# EAGLE design ei2c (EAGLE 7.2.0)
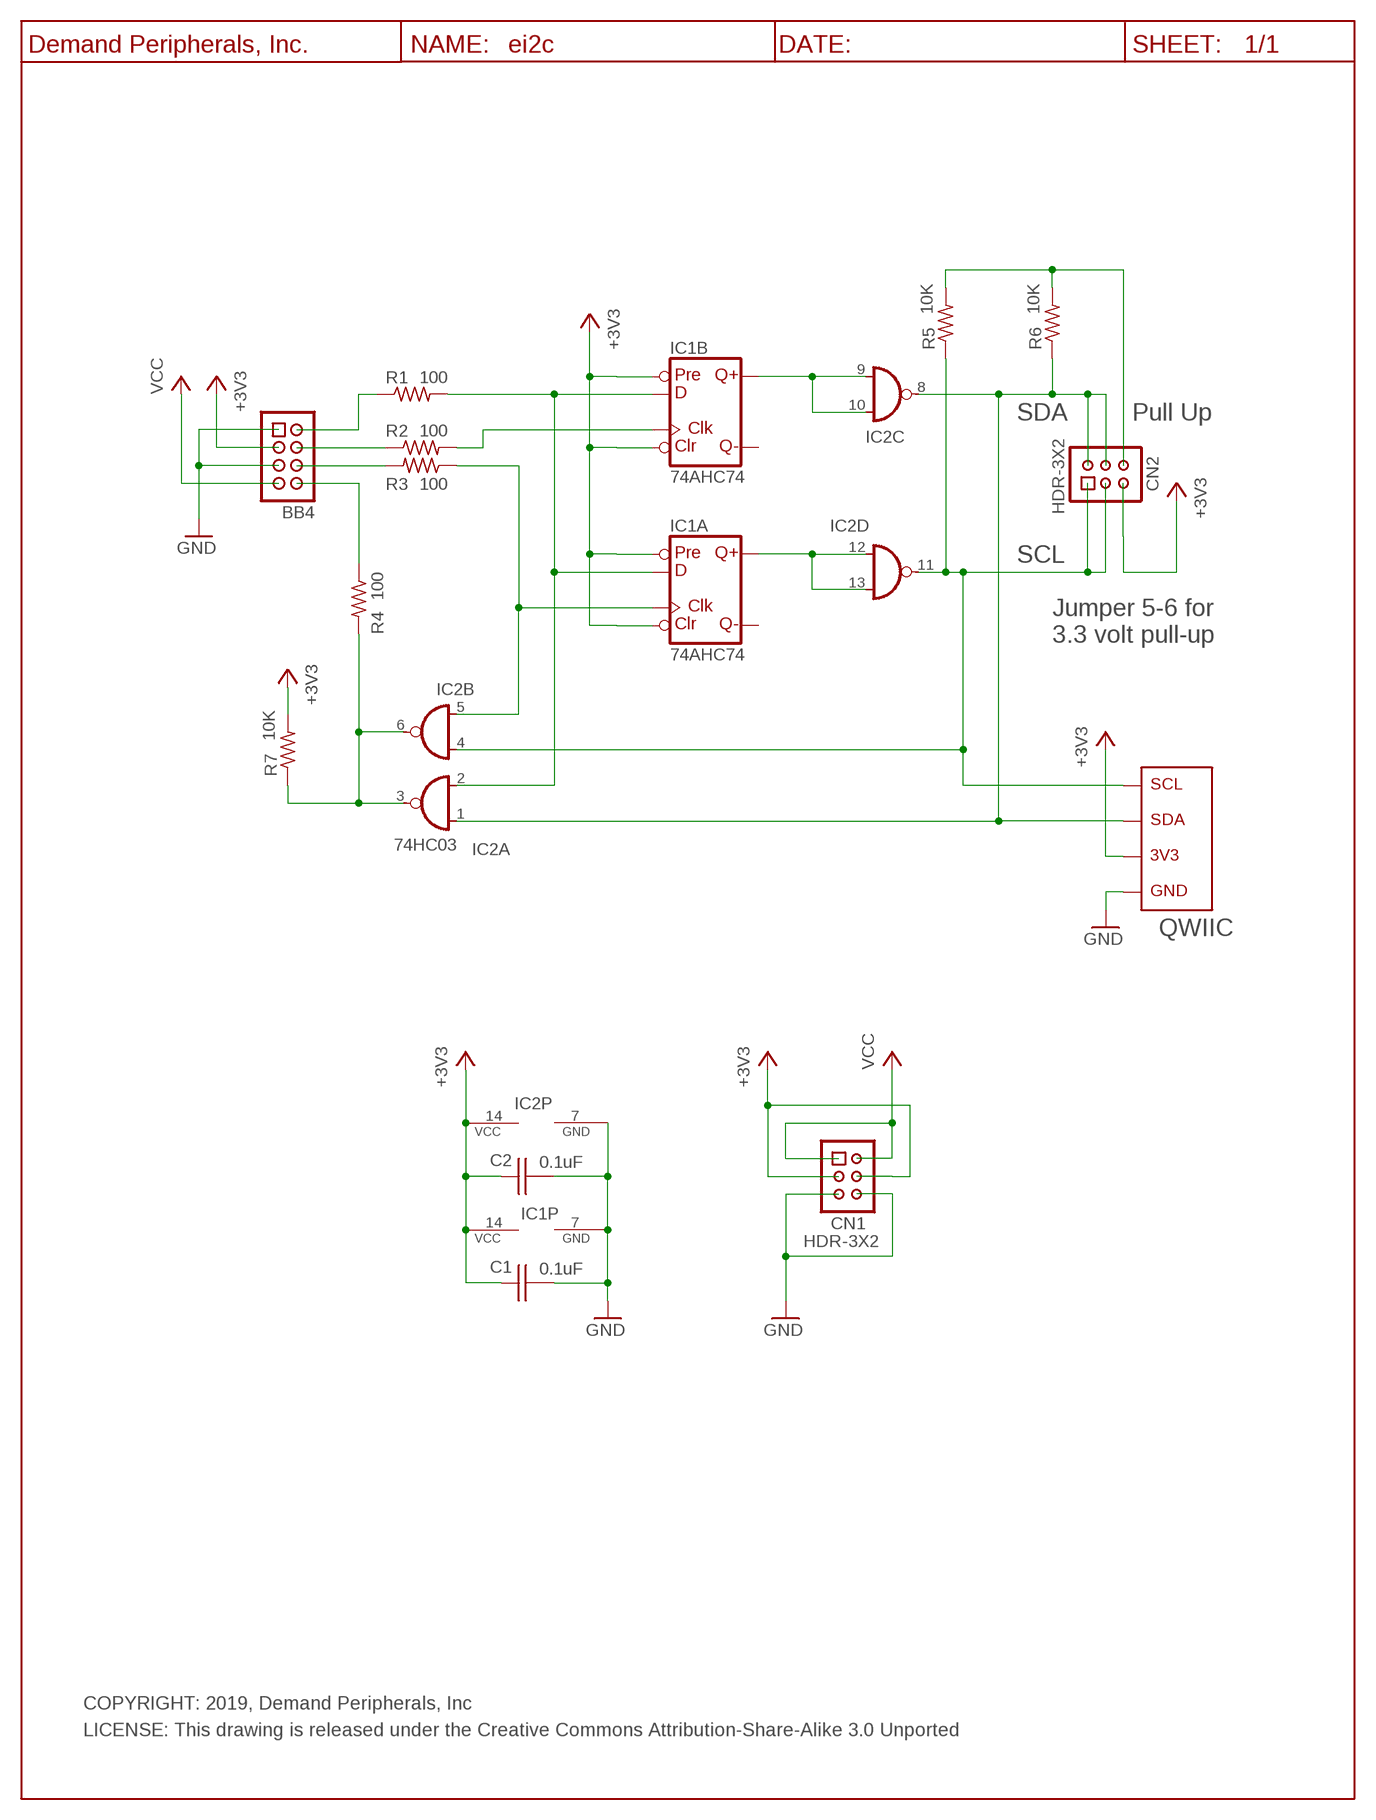
[diagram p0: schematic, sheet 1]

## Parts
BB4  BB_CON  HDR-4X2-SHR  [HDR-4X2]
C1  0.1uF  C0.1UF_C0603  [C0603]
C2  0.1uF  C0.1UF_C0603  [C0603]
CN1  HDR-3X2  [HDR-3X2]
CN2  HDR-3X2  [HDR-3X2]
IC1  74AHC74  74AHC74SS  [SO14]
IC2  74HC03  [SO14]
QWIIC  QWIIC-VCN  [QWIIC]
R1  100  R100_R0603  [R0603]
R2  100  R100_R0603  [R0603]
R3  100  R100_R0603  [R0603]
R4  100  R100_R0603  [R0603]
R5  10K  R10K_R0603  [R0603]
R6  10K  R10K_R0603  [R0603]
R7  10K  R10K_R0603  [R0603]
U$3  DP_FRAME_P  [P_FRAME]

## Nets
+3V3: BB4.3 C1.1 C2.1 CN1.3 CN1.4 CN2.5 IC1.1(A:CLR) IC1.4(A:PRE) IC1.10(B:PRE) IC1.13(B:CLR) IC1.14(P:VCC) IC2.14(P:VCC) QWIIC.2 R7.2
GND: BB4.1 BB4.5 C1.2 C2.2 CN1.5 CN1.6 IC1.7(P:GND) IC2.7(P:GND) QWIIC.1
N$1: IC1.2(A:D) IC1.12(B:D) IC2.2(A:I1) R1.2
N$2: IC1.9(B:Q) IC2.9(C:I0) IC2.10(C:I1)
N$3: IC1.5(A:Q) IC2.12(D:I0) IC2.13(D:I1)
N$4: CN2.2 CN2.4 IC2.1(A:I0) IC2.8(C:O) QWIIC.3 R6.1
N$5: CN2.1 CN2.3 IC2.4(B:I0) IC2.11(D:O) QWIIC.4 R5.1
N$6: CN2.6 R5.2 R6.2
N$7: IC2.3(A:O) IC2.6(B:O) R4.2 R7.1
N$9: BB4.8 R4.1
N$13: IC1.3(A:CLK) IC2.5(B:I1) R3.1
N$14: BB4.4 R2.1
N$16: IC1.11(B:CLK) R2.2
N$19: BB4.6 R3.2
N$20: BB4.2 R1.1
VCC: BB4.7 CN1.1 CN1.2
Unconnected: IC1.6(A:!Q) IC1.8(B:!Q)

## Notes on the sheet
- SDA | Pull Up
- SCL
- Jumper 5-6 for
- 3.3 volt pull-up
- QWIIC
- COPYRIGHT: 2019, Demand Peripherals, Inc
- LICENSE: This drawing is released under the Creative Commons Attribution-Share-Alike 3.0 Unported

## Library data of the parts
BB4 = dpi-conn:HDR-4X2-SHR: Shrouded 4x2 pin header; VENDOR: Digikey; VENDOR-PART-NUM: 609-3530-ND
C1 C2 = dpi-passive:C0.1UF_: 0.1 uF Capacitor, 25V, X7R; VENDOR: Digikey; VENDOR-PART-NUM: 1276-1126-2-ND
CN1 CN2 = dpi-conn:HDR-3X2: Unshrouded 3x2 header with 0.1 inch pitch; VENDOR: Digikey; VENDOR-PART-NUM: 952-2120-ND
IC1 = dpi-transic:74AHC74: Dual D type positive edge triggered FLIP FLOP, preset and clear; VENDOR: Digikey; VENDOR-PART-NUM: 568-4458-1-ND
IC2 = dpi-transic:74*03: Quad 2-input NAND gate, open collector output; VENDOR: Digikey; VENDOR-PART-NUM: 568-1383-6-ND
QWIIC = dpi-conn:QWIIC-V: Qwiic vertical connector
R1-R4 = dpi-passive:R100_: 100 Ohm resistor, 1%, 0.1 watt; VENDOR: Digikey; VENDOR-PART-NUM: 311-100HRTR-ND
R5-R7 = dpi-passive:R10K_: 10K Resistor, 1%, 0.1 watt; VENDOR: Digikey; VENDOR-PART-NUM: 311-1.00KHRTR-ND
U$3 = dpi-sym:DP_FRAME_P: Portrait/Letter Document Frame

## Board
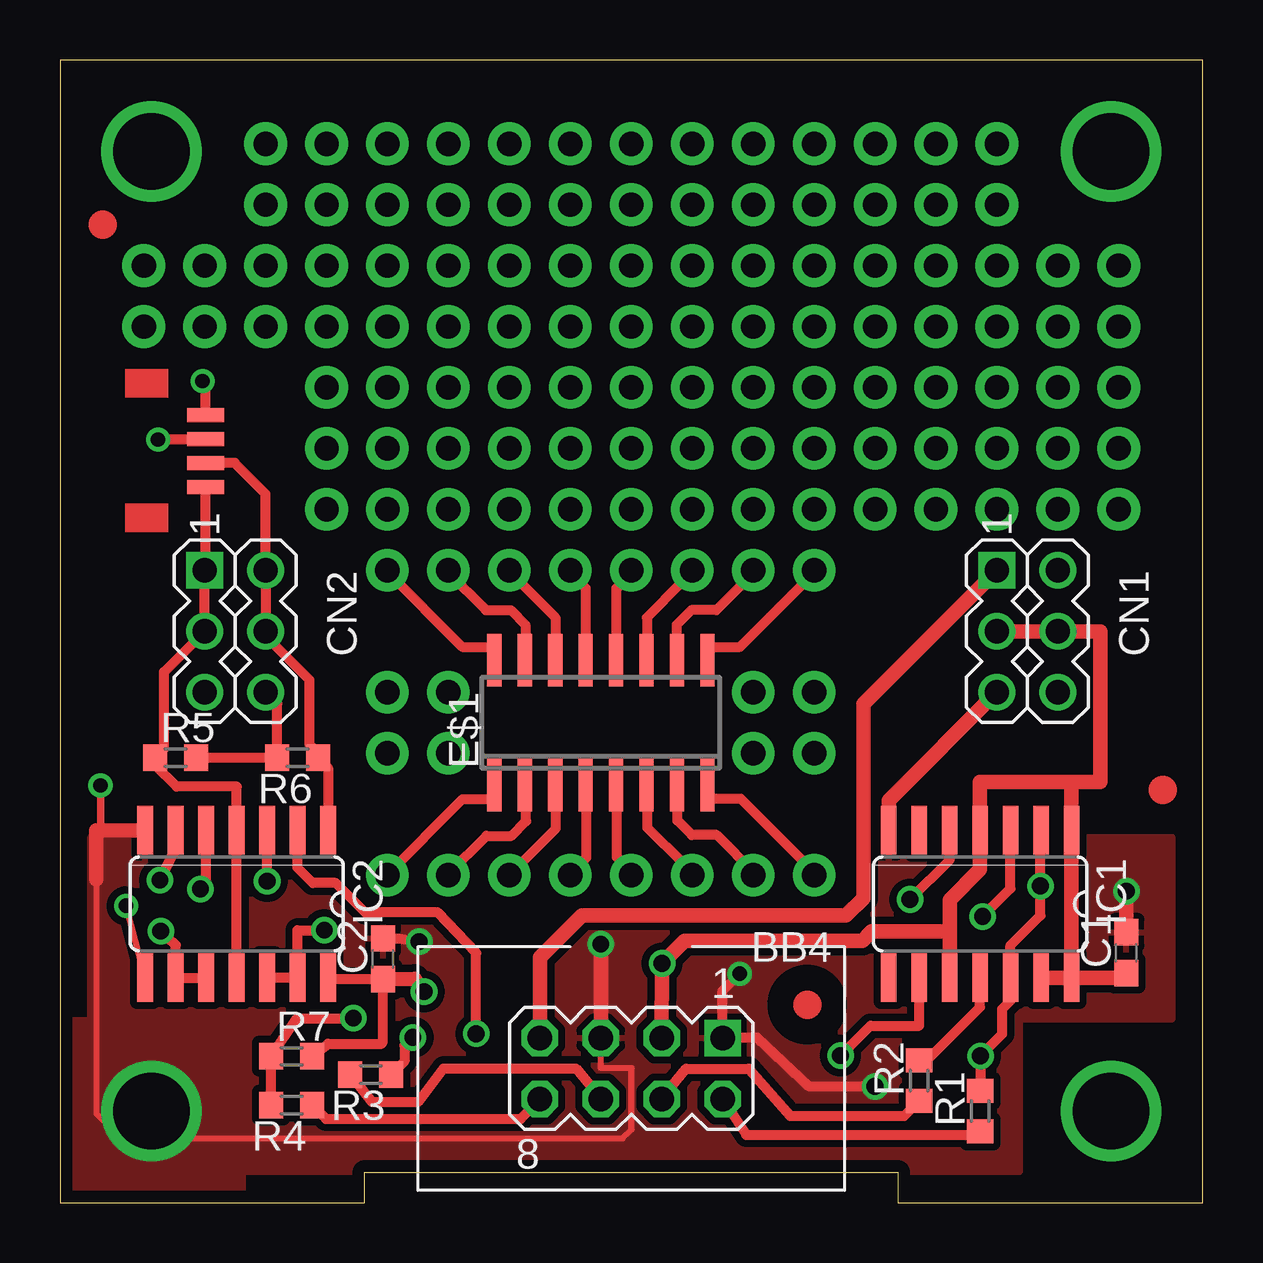
[diagram p1: board, top side]
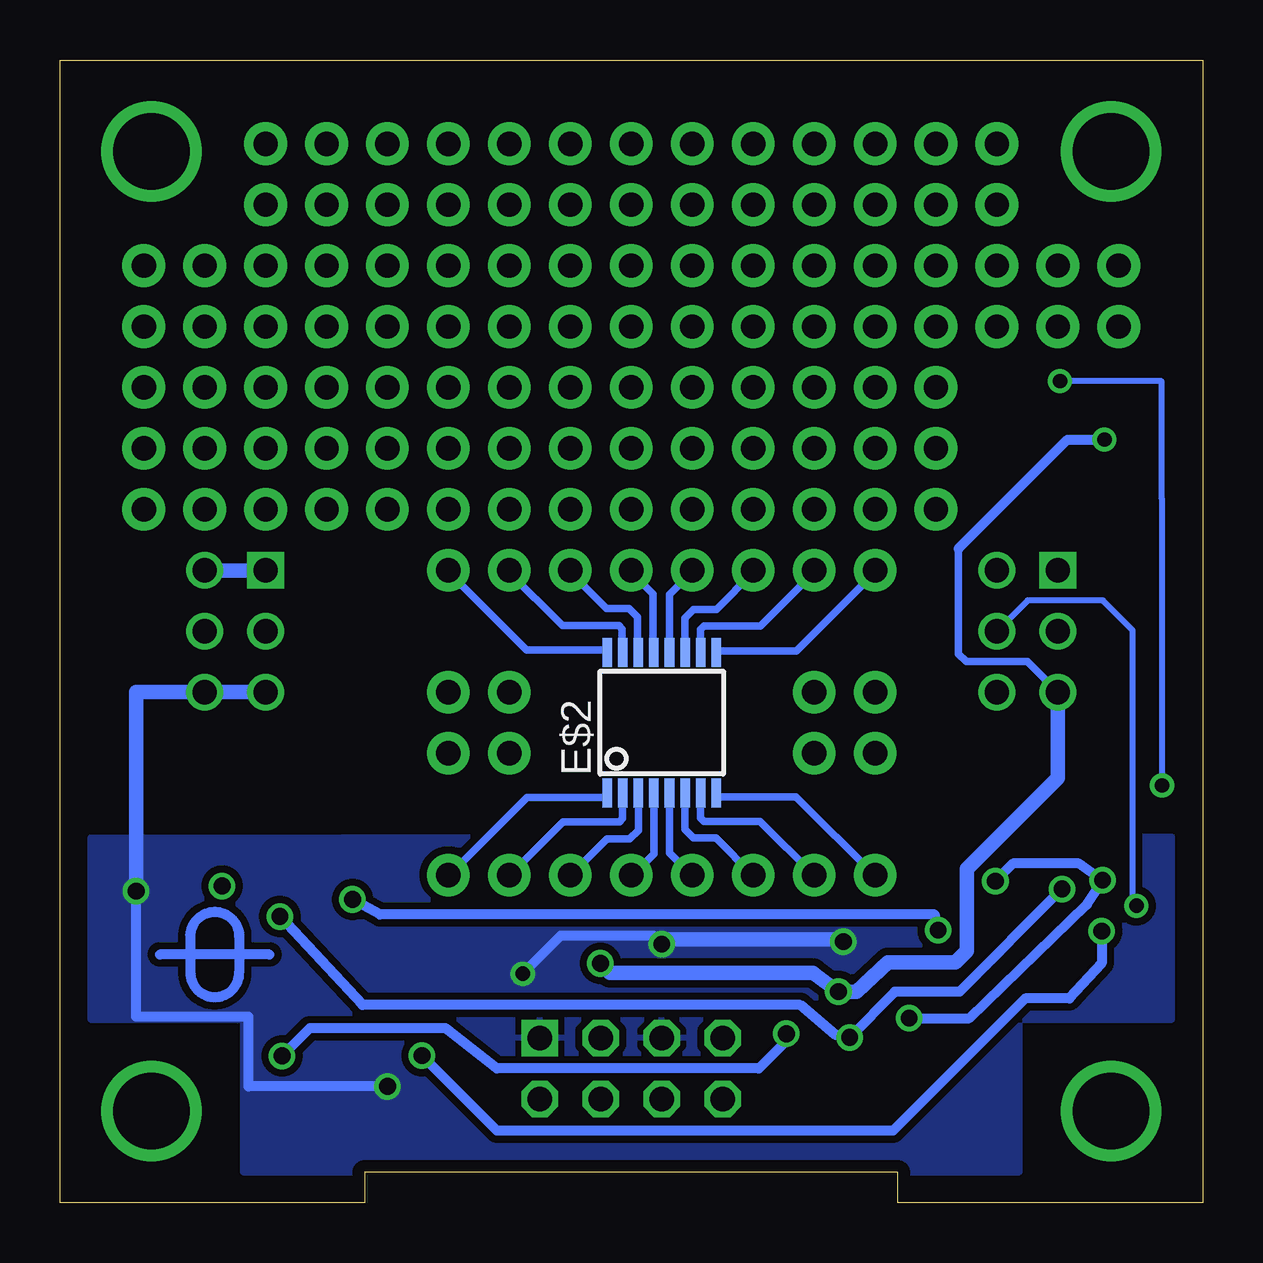
[diagram p2: board, bottom side, seen from below]

Size 47.62 x 47.62 mm. Coordinates in mm from the lower left corner, seen from the top.
Outline: 0,0 12.7,0 12.7,1.27 34.92,1.27 34.92,0 47.62,0 47.62,47.62 0,47.62 0,0
Copper layers (1*16): Top 0.035mm / dielectric 1.5mm / Bottom 0.035mm
Design rules "default *": minimum track width 10mil, minimum drill 20mil, track to track 12mil, track to pad 12mil, pad to pad 12mil, via to via 12mil, smd to smd 10mil, copper to edge 20mil, drill to drill 12mil, minimum pad ring 10mil, minimum via ring 8mil, stop-mask expansion 4mil, vias tented up to drill 0mil, thermal gap 10mil
tKeepout: area 15.1,1 to 32.5,9.7

### Footprints (pad centres in the part's own frame; a part is rotated, then mirrored left to right if it is on the bottom)
HDR-4X2 = drill 1.016 square: 1 -3.81,-1.27 | drill 1.016 octagon: 2 -3.81,1.27; 3 -1.27,-1.27; 4 -1.27,1.27; 5 1.27,-1.27; 6 1.27,1.27; 7 3.81,-1.27; 8 3.81,1.27
C0603 = smd 1.1 x 1: 1 -0.85,0; 2 0.85,0
HDR-3X2 = drill 1.016 square: 1 -2.54,-1.27 | drill 1.016: 2 -2.54,1.27; 3 0,-1.27; 4 0,1.27; 5 2.54,-1.27; 6 2.54,1.27
SO16 = smd 0.6 x 2.2: 1 -4.445,-2.6; 2 -3.175,-2.6; 3 -1.905,-2.6; 4 -0.635,-2.6; 5 0.635,-2.6; 6 1.905,-2.6; 7 3.175,-2.6; 8 4.445,-2.6; 9 4.445,2.6; 10 3.175,2.6; 11 1.905,2.6; 12 0.635,2.6; 13 -0.635,2.6; 14 -1.905,2.6; 15 -3.175,2.6; 16 -4.445,2.6
SSOP16 = smd 0.4 x 1.2: 1 -2.275,-2.925; 2 -1.625,-2.925; 3 -0.975,-2.925; 4 -0.325,-2.925; 5 0.325,-2.925; 6 0.975,-2.925; 7 1.625,-2.925; 8 2.275,-2.925; 9 2.275,2.925; 10 1.625,2.925; 11 0.975,2.925; 12 0.325,2.925; 13 -0.325,2.925; 14 -0.975,2.925; 15 -1.625,2.925; 16 -2.275,2.925
SO14 = smd 0.66 x 2.032: 1 -3.81,-3.073; 2 -2.54,-3.073; 3 -1.27,-3.073; 4 0,-3.073; 5 1.27,-3.073; 6 2.54,-3.073; 7 3.81,-3.073; 8 3.81,3.073; 9 2.54,3.073; 10 1.27,3.073; 11 0,3.073; 12 -1.27,3.073; 13 -2.54,3.073; 14 -3.81,3.073
QWIIC = smd 0.6 x 1.55: 1 -1.48,1.75; 2 -0.48,1.75; 3 0.52,1.75; 4 1.52,1.75
R0603 = smd 1 x 1.1: 1 -0.85,0; 2 0.85,0

### Placement (x,y rotation side)
BB4  23.81,5.59 180 top
C1  44.45,10.41 90 top
C2  13.46,10.16 90 top
CN1  40.32,23.81 270 top
CN2  7.3,23.81 270 top
E$1  [SO16]  22.54,20 0 top
E$2  [SSOP16]  22.54,20 0 bottom
IC1  38.35,12.45 180 top
IC2  7.37,12.45 180 top
QWIIC  4.32,31.34 270 top
R1  38.35,3.81 90 top
R2  35.81,5.08 90 top
R3  12.95,5.33 180 top
R4  9.65,4.06 180 top
R5  4.83,18.54 0 top
R6  9.91,18.54 180 top
R7  9.65,6.1 0 top
U$1  [DPI-1]  41.17,10.34 270 bottom
U$2  [FIDUCIAL]  1.78,40.77 0 top
U$3  -2.54,-2.54 0 top
U$4  [FIDUCIAL]  31.15,8.24 0 top
U$5  [FIDUCIAL]  45.96,17.2 0 top
U$6  [DPI-2]  35.56,24.13 0 bottom

### Tracks (layer width: path | path; a pad name or v marks a point on that pad's centre or on a via)
+3V3  (via drill 0.6, 0.7)
  Top 0.406: IC2.14 11.24,9.31 C2.1 13.46,6.72 13.42,6.62 11.18,6.62 R7.2 | QWIIC.2 6.04,31.8 v4.09,31.8
  Top 0.61: IC1.14 44.26,9.37 C1.1 | IC1.14 IC1.13 | IC1.14 IC1.1 42.16,17.53 | 42.16,17.53 38.35,17.53 IC1.4 38.35,13.89 37.08,12.62 37.08,11.3 | CN1.3 CN1.4 43.37,23.81 43.37,17.53 42.16,17.53 | 37.08,11.3 IC1.10 | 37.08,11.3 33.83,11.3 33.44,10.91 26.04,10.91 v25.09,9.97 BB4.3 | v15.18,8.79 14.77,9.32 C2.1
  Bottom 0.305: 10.17,27.25 10.17,22.87 9.84,22.54 7.3,22.54 CN2.5
  Bottom 0.406: 10.17,27.25 5.63,31.8 v4.09,31.8
  Bottom 0.61: CN2.5 6.03,17.7 9.83,13.91 9.83,10.49 10.3,10.02 13.12,10.02 14.43,8.78 v15.18,8.79 16.24,9.58 24.7,9.58 v25.09,9.97
GND  (via drill 0.6, 0.7, 3.17)
  Top 0.254: IC2.7 3.5,15.52 3.5,16.27 | 1.51,13.47 1.51,3.71 2.55,2.67 3.81,2.67 | 3.81,2.67 23.46,2.67 23.82,3.04 23.82,5.6 22.54,5.6 BB4.5 | v3.81,3.81 3.81,2.67
  Top 0.305: v1.69,17.39 1.69,15.52 1.65,15.52
  Top 0.406: v33.97,4.84 33.47,4.85 31.2,4.85 29.06,6.87 27.64,6.87 BB4.1 27.62,8.83 v28.33,9.54 | C2.2 14.14,11.01 v14.97,10.87 | QWIIC.1 6.07,34.24 v5.94,34.24
  Top 0.61: v44.45,12.98 C1.2 | BB4.5 v22.54,10.77 | CN1.5 34.54,16.76 IC1.7 | IC2.7 1.65,15.52 1.51,15.52 1.51,13.47
  Bottom 0.254: v1.69,17.39 1.7,29.36 1.7,34.24 v5.94,34.24
  Bottom 0.406: v33.97,4.84 39.76,4.84 39.76,7.75 44.45,7.75 v44.45,12.98 | v28.33,9.54 26.75,11.12 22.9,11.12 v22.54,10.77
  Bottom 0.61: v44.45,12.98 44.45,21.27 CN1.6 CN1.5 | v22.54,10.77 22.28,10.96 15.35,10.96 v14.97,10.87
  pour Bottom (isolate 0.305): 7.62,7.62 1.27,7.62 1.27,15.24 25.4,15.24 46.35,15.2 46.35,7.62 40.01,7.62 40.01,1.27 7.62,1.27
  pour Top (isolate 0.254): 0.51,0.51 0.51,7.62 1.27,7.62 1.27,15.24 46.35,15.24 46.35,7.62 40.01,7.62 40.01,1.27 7.62,1.27 7.62,0.51
MOUNT  (via drill 3.17 pad 3.17)
  other vias: 43.81,43.81
N$1  (via drill 0.7)
  Top 0.406: 9.92,15.51 IC2.2 9.91,13.96 10.54,13.32 11.49,13.32 12.71,12.1 15.73,12.1 17.35,10.4 v17.35,7.04 | IC1.2 40.87,15.49 v40.87,13.2 40.87,11.96 39.62,10.72 IC1.12 39.62,8.41 39.28,8.06 39.28,7.02 v38.37,6.11 38.37,4.67 R1.2
  Bottom 0.406: v38.37,6.11 37.21,7.26 31.56,7.26 29.43,5.59 18.49,5.59 17.35,6.74 v17.35,7.04
N$2  (via drill 0.7)
  Top 0.406: IC1.9 35.81,7.37 33.78,7.37 v32.54,6.12 | v4.2,11.32 4.83,10.73 IC2.9 IC2.10
  Bottom 0.406: v4.2,11.32 4.2,9.97 5.55,8.51 7.39,8.51 12.9,3 28.8,3 29.41,3 v32.54,6.12
N$3  (via drill 0.7)
  Top 0.406: IC2.12 IC2.13 9.91,11.35 v11.02,11.35 | IC1.5 37.08,14.29 v35.43,12.64
  Bottom 0.406: v35.43,12.64 34.29,12 11.16,12 v11.02,11.35
N$4  (via drill 0.6)
  Top 0.254: IC2.8 v2.76,12.37
  Top 0.406: IC2.1 11.18,18.12 R6.1 10.76,18.75 10.39,19.11 10.39,21.79 8.57,23.61 CN2.4 CN2.2 8.57,29.54 7.29,30.82 QWIIC.3
  Bottom 0.254: CN2.4 7.29,25.09 4.15,25.09 2.92,23.86 2.92,12.37 v2.76,12.37
N$5
  Top 0.406: IC2.11 IC2.4 7.37,17.34 4.86,17.34 3.98,18.22 R5.1 4.34,18.91 4.34,22.12 CN2.3 CN2.1 6.07,26.35 QWIIC.4
N$6
  Top 0.406: CN2.6 9.06,20.79 R6.2 R5.2
N$7  (via drill 0.7)
  Top 0.406: v12.23,7.68 9.87,7.67 R7.1 R4.2 | IC2.6 4.72,14.53 v4.17,13.44 | v8.64,13.4 IC2.3
  Bottom 0.406: v12.23,7.68 9.73,7.68 4.82,12.43 v4.17,13.44 4.41,13.59 5.16,14.13 7.9,14.13 v8.64,13.4
N$8
  Top 0.406: 18.11,16.82 16.79,16.82 13.61,13.64
N$9
  Top 0.406: 10.76,3.79 R4.1 11.09,3.48 19.2,3.48 BB4.8
N$10
  Top 0.406: 19.43,16.84 19.43,15.9 18.82,15.29 17.78,15.29 16.2,13.72
N$11
  Top 0.406: 20.68,16.56 20.68,15.6 19.2,14.12
N$13  (via drill 0.7)
  Top 0.406: IC1.3 39.62,13.09 v38.46,11.93 | v5.86,13.07 6.1,13.31 IC2.5 | v14.71,6.88 14.36,6.54 14.36,5.89 R3.1
  Bottom 0.406: v5.86,13.07 10.13,8.79 12.84,8.79 12.84,8.75 v14.71,6.88 14.8,6.97 15.28,6.97 16.76,8.23 35.01,8.23 v38.46,11.93
N$14
  Top 0.406: BB4.4 26.1,5.58 28.71,5.58 30.44,3.61 35.19,3.61 R2.1 36.06,4.23
N$16
  Top 0.406: IC1.11 38.35,8.14 36.14,5.93 R2.2
N$17
  Top 0.406: 21.95,16.79 21.95,14.38 21.74,14.17
N$18
  Top 0.406: 27.03,23.16 28.35,23.16 31.52,26.34
N$19
  Top 0.406: BB4.6 21.5,5.59 15.99,5.59 14.95,4.2 12.98,4.2 R3.2
N$20
  Top 0.406: R1.1 38.21,2.82 28.61,2.82 BB4.2
N$23
  Top 0.406: 25.7,23.14 25.7,24.08 26.31,24.69 27.36,24.69 28.93,26.26
N$24
  Top 0.406: 24.46,23.42 24.46,24.38 25.93,25.86
N$31
  Top 0.406: 23.19,23.19 23.19,25.6 23.39,25.81
N$32
  Bottom 0.305: 22.23,16.88 22.23,14.57 21.29,13.63
N$33
  Bottom 0.305: 21.58,16.89 21.58,15.54 21.22,15.19 20.28,15.19 18.73,13.64
N$34
  Bottom 0.305: 20.93,16.92 20.93,16.03 20.79,15.89 18.44,15.89 16.2,13.65
N$35
  Bottom 0.305: 20.27,16.92 16.94,16.92 13.65,13.63
N$36
  Top 0.406: 18.09,23.16 16.76,23.16 13.59,26.34
N$38
  Top 0.406: 19.41,23.14 19.41,24.08 18.8,24.69 17.75,24.69 16.18,26.26
N$39
  Top 0.406: 20.65,23.42 20.65,24.38 19.18,25.86
N$40
  Top 0.406: 21.92,23.19 21.92,25.6 21.72,25.81
N$41
  Top 0.406: 27.05,16.84 28.37,16.84 31.55,13.66
N$42
  Top 0.406: 25.73,16.87 25.73,15.93 26.34,15.32 27.38,15.32 28.96,13.74
N$43
  Top 0.406: 24.49,16.59 24.49,15.62 25.96,14.15
N$44
  Top 0.406: 23.22,16.82 23.22,14.4 23.42,14.2
N$46  (via drill 3.17 pad 3.17)
  other vias: 43.81,3.81
N$47  (via drill 3.17 pad 3.17)
  other vias: 3.81,43.81
N$71
  Bottom 0.305: 22.9,23.06 22.9,25.38 23.84,26.31
N$72
  Bottom 0.305: 23.55,23.05 23.55,24.4 23.9,24.75 24.84,24.75 26.39,26.3
N$73
  Bottom 0.305: 24.19,23.02 24.19,23.91 24.33,24.05 26.68,24.05 28.92,26.29
N$74
  Bottom 0.305: 24.85,23.02 28.18,23.02 31.47,26.31
N$75
  Bottom 0.305: 22.87,16.85 22.87,14.54 23.81,13.6
N$76
  Bottom 0.305: 23.52,16.87 23.52,15.52 23.88,15.16 24.82,15.16 26.36,13.61
N$77
  Bottom 0.305: 24.17,16.89 24.17,16 24.31,15.86 26.66,15.86 28.89,13.63
N$78
  Bottom 0.305: 24.83,16.89 28.16,16.89 31.45,13.6
N$79
  Bottom 0.305: 22.21,23.04 22.21,25.35 21.27,26.29
N$80
  Bottom 0.305: 21.57,23.02 21.57,24.37 21.21,24.73 20.27,24.73 18.72,26.28
N$81
  Bottom 0.305: 20.92,23 20.92,23.89 20.78,24.03 18.43,24.03 16.19,26.26
N$82
  Bottom 0.305: 20.26,23 16.93,23 13.64,26.29
VCC
  Top 0.61: CN1.1 33.49,20.79 33.49,12.69 32.77,11.96 21.75,11.96 20,10.21 BB4.7
  Bottom 0.61: CN1.1 CN1.2
WW9  (via drill 1.02 pad 1.78)
  other vias: 3.49,36.51
WW10  (via drill 1.02 pad 1.78)
  other vias: 3.49,39.05
WW22  (via drill 1.02 pad 1.78)
  other vias: 6.03,36.51
WW23  (via drill 1.02 pad 1.78)
  other vias: 6.03,39.05
WW35  (via drill 1.02 pad 1.78)
  other vias: 8.57,36.51
WW36  (via drill 1.02 pad 1.78)
  other vias: 8.57,39.05
WW37  (via drill 1.02 pad 1.78)
  other vias: 8.57,41.59
WW38  (via drill 1.02 pad 1.78)
  other vias: 8.57,44.13
WW45  (via drill 1.02 pad 1.78)
  other vias: 11.11,28.89
WW46  (via drill 1.02 pad 1.78)
  other vias: 11.11,31.43
WW47  (via drill 1.02 pad 1.78)
  other vias: 11.11,33.97
WW48  (via drill 1.02 pad 1.78)
  other vias: 11.11,36.51
WW49  (via drill 1.02 pad 1.78)
  other vias: 11.11,39.05
WW50  (via drill 1.02 pad 1.78)
  other vias: 11.11,41.59
WW51  (via drill 1.02 pad 1.78)
  other vias: 11.11,44.13
WW52  (via drill 1.02 pad 1.78)
  other vias: 13.65,13.65
WW54  (via drill 1.02 pad 1.78)
  other vias: 13.65,18.73
WW55  (via drill 1.02 pad 1.78)
  other vias: 13.65,21.27
WW57  (via drill 1.02 pad 1.78)
  other vias: 13.65,26.35
WW58  (via drill 1.02 pad 1.78)
  other vias: 13.65,28.89
WW59  (via drill 1.02 pad 1.78)
  other vias: 13.65,31.43
WW60  (via drill 1.02 pad 1.78)
  other vias: 13.65,33.97
WW61  (via drill 1.02 pad 1.78)
  other vias: 13.65,36.51
WW62  (via drill 1.02 pad 1.78)
  other vias: 13.65,39.05
WW63  (via drill 1.02 pad 1.78)
  other vias: 13.65,41.59
WW64  (via drill 1.02 pad 1.78)
  other vias: 13.65,44.13
WW65  (via drill 1.02 pad 1.78)
  other vias: 16.19,13.65
WW67  (via drill 1.02 pad 1.78)
  other vias: 16.19,18.73
WW68  (via drill 1.02 pad 1.78)
  other vias: 16.19,21.27
WW70  (via drill 1.02 pad 1.78)
  other vias: 16.19,26.35
WW71  (via drill 1.02 pad 1.78)
  other vias: 16.19,28.89
WW72  (via drill 1.02 pad 1.78)
  other vias: 16.19,31.43
WW73  (via drill 1.02 pad 1.78)
  other vias: 16.19,33.97
WW74  (via drill 1.02 pad 1.78)
  other vias: 16.19,36.51
WW75  (via drill 1.02 pad 1.78)
  other vias: 16.19,39.05
WW76  (via drill 1.02 pad 1.78)
  other vias: 16.19,41.59
WW77  (via drill 1.02 pad 1.78)
  other vias: 16.19,44.13
WW78  (via drill 1.02 pad 1.78)
  other vias: 18.73,13.65
WW83  (via drill 1.02 pad 1.78)
  other vias: 18.73,26.35
WW84  (via drill 1.02 pad 1.78)
  other vias: 18.73,28.89
WW85  (via drill 1.02 pad 1.78)
  other vias: 18.73,31.43
WW86  (via drill 1.02 pad 1.78)
  other vias: 18.73,33.97
WW87  (via drill 1.02 pad 1.78)
  other vias: 18.73,36.51
WW88  (via drill 1.02 pad 1.78)
  other vias: 18.73,39.05
WW89  (via drill 1.02 pad 1.78)
  other vias: 18.73,41.59
WW90  (via drill 1.02 pad 1.78)
  other vias: 18.73,44.13
WW91  (via drill 1.02 pad 1.78)
  other vias: 21.27,13.65
WW96  (via drill 1.02 pad 1.78)
  other vias: 21.27,26.35
WW97  (via drill 1.02 pad 1.78)
  other vias: 21.27,28.89
WW98  (via drill 1.02 pad 1.78)
  other vias: 21.27,31.43
WW99  (via drill 1.02 pad 1.78)
  other vias: 21.27,33.97
WW100  (via drill 1.02 pad 1.78)
  other vias: 21.27,36.51
WW101  (via drill 1.02 pad 1.78)
  other vias: 21.27,39.05
WW102  (via drill 1.02 pad 1.78)
  other vias: 21.27,41.59
WW103  (via drill 1.02 pad 1.78)
  other vias: 21.27,44.13
WW104  (via drill 1.02 pad 1.78)
  other vias: 23.81,13.65
WW109  (via drill 1.02 pad 1.78)
  other vias: 23.81,26.35
WW110  (via drill 1.02 pad 1.78)
  other vias: 23.81,28.89
WW111  (via drill 1.02 pad 1.78)
  other vias: 23.81,31.43
WW112  (via drill 1.02 pad 1.78)
  other vias: 23.81,33.97
WW113  (via drill 1.02 pad 1.78)
  other vias: 23.81,36.51
WW114  (via drill 1.02 pad 1.78)
  other vias: 23.81,39.05
WW115  (via drill 1.02 pad 1.78)
  other vias: 23.81,41.59
WW116  (via drill 1.02 pad 1.78)
  other vias: 23.81,44.13
WW117  (via drill 1.02 pad 1.78)
  other vias: 26.35,13.65
WW122  (via drill 1.02 pad 1.78)
  other vias: 26.35,26.35
WW123  (via drill 1.02 pad 1.78)
  other vias: 26.35,28.89
WW124  (via drill 1.02 pad 1.78)
  other vias: 26.35,31.43
WW125  (via drill 1.02 pad 1.78)
  other vias: 26.35,33.97
WW126  (via drill 1.02 pad 1.78)
  other vias: 26.35,36.51
WW127  (via drill 1.02 pad 1.78)
  other vias: 26.35,39.05
WW128  (via drill 1.02 pad 1.78)
  other vias: 26.35,41.59
WW129  (via drill 1.02 pad 1.78)
  other vias: 26.35,44.13
WW130  (via drill 1.02 pad 1.78)
  other vias: 28.89,13.65
WW132  (via drill 1.02 pad 1.78)
  other vias: 28.89,18.73
WW133  (via drill 1.02 pad 1.78)
  other vias: 28.89,21.27
WW135  (via drill 1.02 pad 1.78)
  other vias: 28.89,26.35
WW136  (via drill 1.02 pad 1.78)
  other vias: 28.89,28.89
WW137  (via drill 1.02 pad 1.78)
  other vias: 28.89,31.43
WW138  (via drill 1.02 pad 1.78)
  other vias: 28.89,33.97
WW139  (via drill 1.02 pad 1.78)
  other vias: 28.89,36.51
WW140  (via drill 1.02 pad 1.78)
  other vias: 28.89,39.05
WW141  (via drill 1.02 pad 1.78)
  other vias: 28.89,41.59
WW142  (via drill 1.02 pad 1.78)
  other vias: 28.89,44.13
WW143  (via drill 1.02 pad 1.78)
  other vias: 31.43,13.65
WW145  (via drill 1.02 pad 1.78)
  other vias: 31.43,18.73
WW146  (via drill 1.02 pad 1.78)
  other vias: 31.43,21.27
WW148  (via drill 1.02 pad 1.78)
  other vias: 31.43,26.35
WW149  (via drill 1.02 pad 1.78)
  other vias: 31.43,28.89
WW150  (via drill 1.02 pad 1.78)
  other vias: 31.43,31.43
WW151  (via drill 1.02 pad 1.78)
  other vias: 31.43,33.97
WW152  (via drill 1.02 pad 1.78)
  other vias: 31.43,36.51
WW153  (via drill 1.02 pad 1.78)
  other vias: 31.43,39.05
WW154  (via drill 1.02 pad 1.78)
  other vias: 31.43,41.59
WW155  (via drill 1.02 pad 1.78)
  other vias: 31.43,44.13
WW162  (via drill 1.02 pad 1.78)
  other vias: 33.97,28.89
WW163  (via drill 1.02 pad 1.78)
  other vias: 33.97,31.43
WW164  (via drill 1.02 pad 1.78)
  other vias: 33.97,33.97
WW165  (via drill 1.02 pad 1.78)
  other vias: 33.97,36.51
WW166  (via drill 1.02 pad 1.78)
  other vias: 33.97,39.05
WW167  (via drill 1.02 pad 1.78)
  other vias: 33.97,41.59
WW168  (via drill 1.02 pad 1.78)
  other vias: 33.97,44.13
WW175  (via drill 1.02 pad 1.78)
  other vias: 36.51,28.89
WW176  (via drill 1.02 pad 1.78)
  other vias: 36.51,31.43
WW177  (via drill 1.02 pad 1.78)
  other vias: 36.51,33.97
WW178  (via drill 1.02 pad 1.78)
  other vias: 36.51,36.51
WW179  (via drill 1.02 pad 1.78)
  other vias: 36.51,39.05
WW180  (via drill 1.02 pad 1.78)
  other vias: 36.51,41.59
WW181  (via drill 1.02 pad 1.78)
  other vias: 36.51,44.13
WW188  (via drill 1.02 pad 1.78)
  other vias: 39.05,28.89
WW189  (via drill 1.02 pad 1.78)
  other vias: 39.05,31.43
WW190  (via drill 1.02 pad 1.78)
  other vias: 39.05,33.97
WW191  (via drill 1.02 pad 1.78)
  other vias: 39.05,36.51
WW192  (via drill 1.02 pad 1.78)
  other vias: 39.05,39.05
WW193  (via drill 1.02 pad 1.78)
  other vias: 39.05,41.59
WW194  (via drill 1.02 pad 1.78)
  other vias: 39.05,44.13
WW201  (via drill 1.02 pad 1.78)
  other vias: 41.59,28.89
WW202  (via drill 1.02 pad 1.78)
  other vias: 41.59,31.43
WW203  (via drill 1.02 pad 1.78)
  other vias: 41.59,33.97
WW204  (via drill 1.02 pad 1.78)
  other vias: 41.59,36.51
WW205  (via drill 1.02 pad 1.78)
  other vias: 41.59,39.05
WW214  (via drill 1.02 pad 1.78)
  other vias: 44.13,28.89
WW215  (via drill 1.02 pad 1.78)
  other vias: 44.13,31.43
WW216  (via drill 1.02 pad 1.78)
  other vias: 44.13,33.97
WW217  (via drill 1.02 pad 1.78)
  other vias: 44.13,36.51
WW218  (via drill 1.02 pad 1.78)
  other vias: 44.13,39.05

### Text on the board
tTest: 1.875 Inches | 1.575 Inches | (C) 2019, Demand Peripherals, Inc. | QWIIC | GND | 3.3 | SDA | SCL | SCL | 5 | 5 | 3 | SDA | 3 | 3 | G | G | PUP | EI2C, Rev 19A | R5 | R6 | IC2 | 1.575 Inches | 1.875 Inches | IC1 | C1 | R7 | C2 | R2 | R1 | R3 | R4